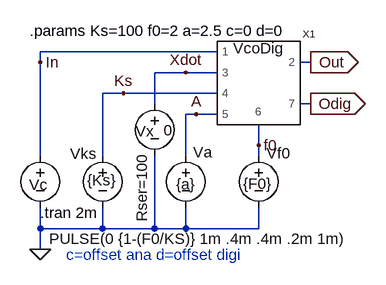
[diagram p0: schematic VcoJer.asc]
VcoJer.asc, the LTspice schematic file:
Version 4
SHEET 1 880 680
WIRE -304 160 -304 144
WIRE -304 304 -304 160
WIRE -304 416 -304 384
WIRE -304 448 -304 416
WIRE -208 304 -208 208
WIRE -208 416 -304 416
WIRE -208 416 -208 384
WIRE -176 208 -208 208
WIRE -128 224 -128 176
WIRE -128 416 -208 416
WIRE -128 416 -128 304
WIRE -80 176 -128 176
WIRE -80 304 -80 240
WIRE -80 416 -128 416
WIRE -80 416 -80 384
WIRE -64 240 -80 240
WIRE -32 144 -304 144
WIRE -32 176 -80 176
WIRE -32 208 -176 208
WIRE -32 240 -64 240
WIRE 32 288 32 256
WIRE 32 304 32 288
WIRE 32 416 -80 416
WIRE 32 416 32 384
WIRE 112 160 96 160
WIRE 112 224 96 224
FLAG -304 448 0
FLAG 112 160 Out
IOPIN 112 160 Out
FLAG -304 160 In
FLAG -176 208 Ks
FLAG -80 176 Xdot
FLAG -64 240 A
FLAG 32 288 f0
FLAG 112 224 Odig
IOPIN 112 224 Out
SYMBOL voltage -304 288 R0
WINDOW 0 -17 61 Left 0
WINDOW 123 0 0 Left 0
WINDOW 39 0 0 Left 0
WINDOW 3 473 144 Right 0
SYMATTR InstName Vc
SYMATTR Value PULSE(0 {1-(F0/KS)} 1m .4m .4m .2m 1m)
SYMBOL voltage -208 288 R0
WINDOW 0 -50 13 Left 0
WINDOW 123 0 0 Left 0
WINDOW 39 0 0 Left 0
WINDOW 3 -24 54 Left 0
SYMATTR InstName Vks
SYMATTR Value {Ks}
SYMBOL voltage 32 288 R0
WINDOW 0 12 12 Left 0
WINDOW 123 0 0 Left 0
WINDOW 39 0 0 Left 0
WINDOW 3 -24 59 Left 0
SYMATTR InstName Vf0
SYMATTR Value {F0}
SYMBOL voltage -80 288 R0
WINDOW 0 11 11 Left 0
WINDOW 123 0 0 Left 0
WINDOW 39 0 0 Left 0
WINDOW 3 -15 60 Left 0
SYMATTR InstName Va
SYMATTR Value {a}
SYMBOL voltage -128 208 R0
WINDOW 0 -29 58 Left 0
WINDOW 3 14 57 Left 0
WINDOW 123 0 0 Left 0
WINDOW 39 -20 92 VRight 0
SYMATTR InstName Vx
SYMATTR Value 0
SYMATTR SpiceLine Rser=100
SYMBOL vcodig 32 192 R0
SYMATTR InstName X1
TEXT -304 392 Left 0 !.tran 2m
TEXT -320 112 Left 0 !.params Ks=100 f0=2 a=2.5 c=0 d=0
TEXT -264 456 Left 0 ;c=offset ana d=offset digi

The netlist it stands for:
* VcoJer.asc
Vc In 0 PULSE(0 {1-(F0/KS)} 1m .4m .4m .2m 1m)
Vks Ks 0 {Ks}
Vf0 f0 0 {F0}
Va A 0 {a}
Vx Xdot 0 0 Rser=100
XX1 In Out Xdot Ks A f0 Odig vcodig params: VcoDig  ; pins 1 2 3 4 5 6 7
.tran 2m
.params Ks=100 f0=2 a=2.5 c=0 d=0
* c=offset ana d=offset digi
.backanno
.end